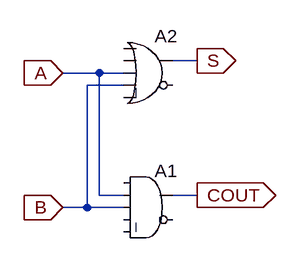
[diagram p0: schematic halfsum.asc]
halfsum.asc, the LTspice schematic file:
Version 4
SHEET 1 880 680
WIRE 272 -48 240 -48
WIRE 144 -32 96 -32
WIRE 176 -32 144 -32
WIRE 176 -16 128 -16
WIRE 144 128 144 -32
WIRE 176 128 144 128
WIRE 272 128 240 128
WIRE 128 144 128 -16
WIRE 128 144 96 144
WIRE 176 144 128 144
FLAG 96 -32 A
IOPIN 96 -32 In
FLAG 96 144 B
IOPIN 96 144 In
FLAG 272 -48 S
IOPIN 272 -48 Out
FLAG 272 128 COUT
IOPIN 272 128 Out
SYMBOL Digital\\and 208 80 R0
SYMATTR InstName A1
SYMBOL Digital\\or 208 -96 R0
SYMATTR InstName A2

The netlist it stands for:
* halfsum.asc
A1 0 A B 0 0 0 COUT 0 AND
A2 0 0 A B 0 0 S 0 OR
.backanno
.end